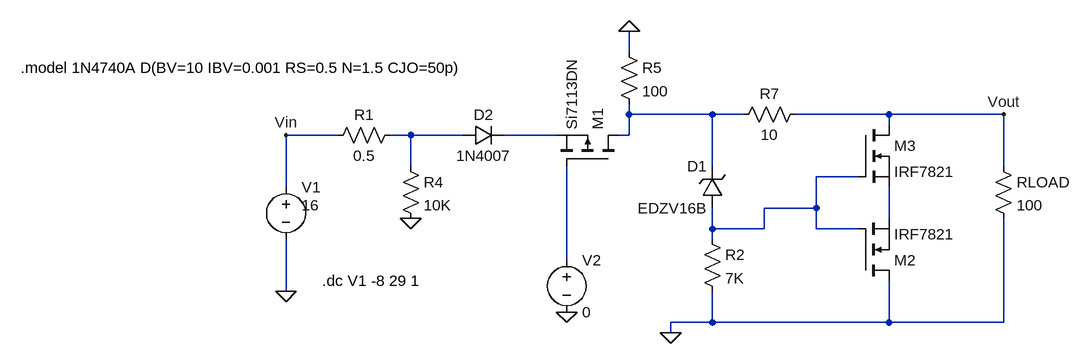
[diagram p0: schematic ReversePolarity_Crowbar_Protection.asc]
ReversePolarity_Crowbar_Protection.asc, the LTspice schematic file:
Version 4
SHEET 1 1460 680
WIRE 192 32 192 0
WIRE 192 128 192 112
WIRE 320 128 192 128
WIRE 368 128 320 128
WIRE 592 128 448 128
WIRE 768 128 592 128
WIRE 592 144 592 128
WIRE -256 160 -336 160
WIRE -144 160 -176 160
WIRE -64 160 -144 160
WIRE 80 160 0 160
WIRE 192 160 192 128
WIRE 192 160 176 160
WIRE -144 208 -144 160
WIRE 320 208 320 128
WIRE 768 208 768 128
WIRE 544 224 480 224
WIRE -336 240 -336 160
WIRE 480 272 480 224
WIRE 480 272 400 272
WIRE 592 288 592 240
WIRE 320 304 320 272
WIRE 400 304 400 272
WIRE 400 304 320 304
WIRE 480 304 480 272
WIRE 544 304 480 304
WIRE 320 320 320 304
WIRE 96 352 96 208
WIRE -336 400 -336 320
WIRE 320 448 320 400
WIRE 320 448 256 448
WIRE 592 448 592 384
WIRE 592 448 320 448
WIRE 768 448 768 288
WIRE 768 448 592 448
WIRE 256 464 256 448
FLAG -336 400 0
FLAG 256 464 0
FLAG -144 288 0
FLAG 96 432 0
FLAG 192 0 0
FLAG 768 128 Vout
FLAG -336 160 Vin
SYMBOL voltage -336 224 R0
WINDOW 3 24 44 Left 2
WINDOW 123 0 0 Left 0
WINDOW 39 0 0 Left 0
SYMATTR Value 16
SYMATTR InstName V1
SYMBOL pmos 176 208 M270
SYMATTR InstName M1
SYMATTR Value Si7113DN
SYMBOL res -160 144 R90
WINDOW 0 0 56 VBottom 2
WINDOW 3 32 56 VTop 2
SYMATTR InstName R1
SYMATTR Value 0.5
SYMBOL zener 336 272 R180
WINDOW 0 24 64 Left 2
WINDOW 3 24 0 Left 2
SYMATTR InstName D1
SYMATTR Value EDZV16B
SYMBOL res 304 304 R0
SYMATTR InstName R2
SYMATTR Value 7K
SYMBOL res 752 192 R0
SYMATTR InstName RLOAD
SYMATTR Value 100
SYMBOL res -160 192 R0
SYMATTR InstName R4
SYMATTR Value 10K
SYMBOL res 176 16 R0
SYMATTR InstName R5
SYMATTR Value 100
SYMBOL voltage 96 336 R0
WINDOW 123 0 0 Left 0
WINDOW 39 0 0 Left 0
SYMATTR InstName V2
SYMATTR Value 0
SYMBOL diode -64 176 R270
WINDOW 0 32 32 VTop 2
WINDOW 3 0 32 VBottom 2
SYMATTR InstName D2
SYMATTR Value 1N4007
SYMBOL nmos 544 144 R0
SYMATTR InstName M3
SYMATTR Value IRF7821
SYMBOL nmos 544 384 M180
SYMATTR InstName M2
SYMATTR Value IRF7821
SYMBOL res 464 112 R90
WINDOW 0 0 56 VBottom 2
WINDOW 3 32 56 VTop 2
SYMATTR InstName R7
SYMATTR Value 10
TEXT -744 56 Left 2 !.model 1N4740A D(BV=10 IBV=0.001 RS=0.5 N=1.5 CJO=50p)
TEXT -280 384 Left 2 !.dc V1 -8 29 1

The netlist it stands for:
* ReversePolarity_Crowbar_Protection.asc
V1 Vin 0 16
M1 N001 N006 N003 N003 Si7113DN
R1 N002 Vin 0.5
D1 N004 N001 EDZV16B
R2 N004 0 7K
RLOAD Vout 0 100
R4 N002 0 10K
R5 0 N001 100
V2 N006 0 0
D2 N002 N003 1N4007
M3 Vout N004 N005 N005 IRF7821
M2 0 N004 N005 N005 IRF7821
R7 Vout N001 10
.model D D
.lib standard.dio
.model NMOS NMOS
.model PMOS PMOS
.lib standard.mos
.model 1N4740A D(BV=10 IBV=0.001 RS=0.5 N=1.5 CJO=50p)
.dc V1 -8 29 1
.backanno
.end